# EAGLE design z0-probe_v2 (EAGLE 9.4.1)
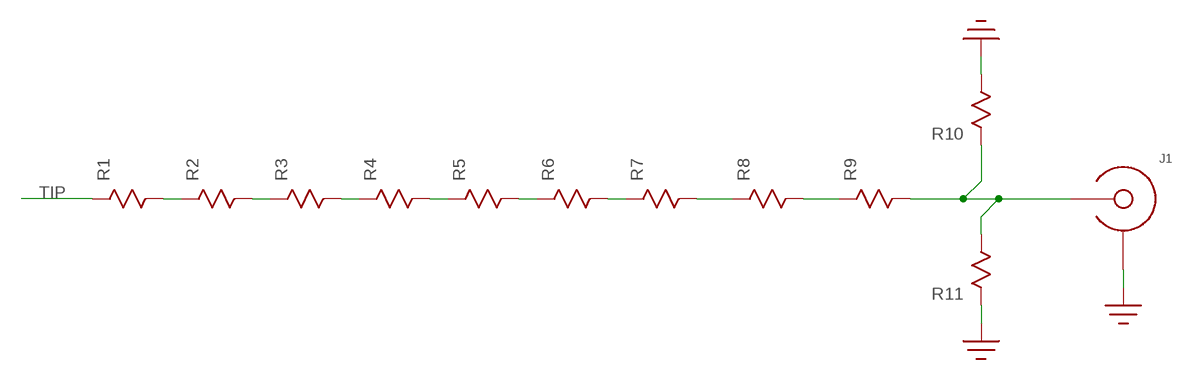
[diagram p0: schematic, sheet 1]

## Parts
J1  SMA-EDGE-LAUNCH  [SMA_EDGE_LAUNCH_2L_4020_TAPER_FIXED]
R1  R0603  [R0603]
R2  R0603  [R0603]
R3  R0603  [R0603]
R4  R0603  [R0603]
R5  R0603  [R0603]
R6  R0603  [R0603]
R7  R0603  [R0603]
R8  R0603  [R0603]
R9  R0603  [R0603]
R10  R0603  [R0603]
R11  R0603  [R0603]

## Nets
GND: J1.BOTTOM_GND(SHIELD) J1.GND@1(SHIELD) J1.GND@2(SHIELD) J1.GND@3(SHIELD) J1.GND@4(SHIELD) J1.GND@5(SHIELD) J1.GND@6(SHIELD) J1.GND@7(SHIELD) J1.GND@8(SHIELD) J1.GND@14(SHIELD) J1.GND@15(SHIELD) J1.GND@16(SHIELD) J1.GND@17(SHIELD) J1.GND_PAD1(SHIELD) J1.GND_PAD2(SHIELD) J1.P$1(SHIELD) J1.P$2(SHIELD) R10.P$2 R11.P$1
N$1: R1.P$2 R2.P$1
N$2: R2.P$2 R3.P$1
N$3: R3.P$2 R4.P$1
N$4: R4.P$2 R5.P$1
N$5: R5.P$2 R6.P$1
N$6: R6.P$2 R7.P$1
N$7: R7.P$2 R8.P$1
N$8: R8.P$2 R9.P$1
N$9: J1.CENTER@1(CENTER) J1.P$3(CENTER) R9.P$2 R10.P$1 R11.P$2
TIP: R1.P$1

## Library data of the parts
J1 = sma_footprint_2l:SMA-EDGE-LAUNCH
R1-R11 = yapo:R

## Board
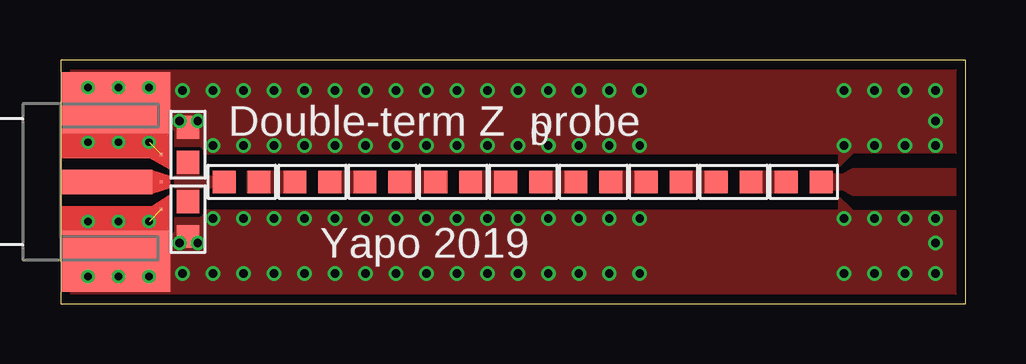
[diagram p1: board, top side]
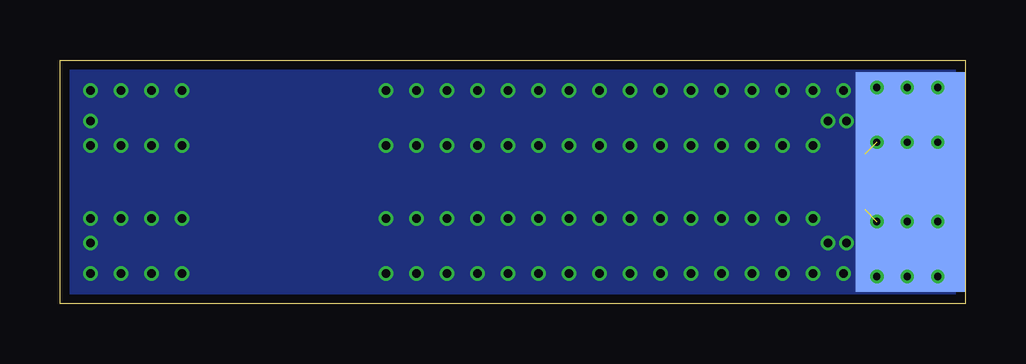
[diagram p2: board, bottom side, seen from below]

Size 37.72 x 10.16 mm. Coordinates in mm from the lower left corner, seen from the top.
Outline: 0,0 37.72,0 37.72,10.16 0,10.16 0,0
Copper layers (1*16): Top 0.035559375mm / dielectric 1.6mm / Bottom 0.035559375mm
Design rules "oshpark-2layer *": minimum track width 6mil, minimum drill 10mil, track to track 6mil, track to pad 6mil, pad to pad 6mil, via to via 6mil, smd to smd 6mil, copper to edge 15mil, drill to drill 6mil, minimum pad ring 5mil, minimum via ring 5mil, stop-mask expansion 2.5mil, vias tented up to drill 20mil, thermal gap 10mil

### Footprints (pad centres in the part's own frame; a part is rotated, then mirrored left to right if it is on the bottom)
SMA_EDGE_LAUNCH_2L_4020_TAPER_FIXED = smd 4.572 x 9.144 bottom: BOTTOM_GND 2.286,0 | smd 3.81 x 1.016: CENTER@1 1.905,0 | drill 0.3: GND@1 1.143,3.937; GND@2 3.683,3.937; GND@3 1.143,1.651; GND@4 3.683,1.651; GND@5 1.143,-1.651; GND@6 3.683,-1.651; GND@7 1.143,-3.937; GND@8 3.683,-3.937; GND@14 2.413,3.937; GND@15 2.413,-3.937; GND@16 2.413,-1.651; GND@17 2.413,1.651 | smd 4.572 x 2.54: GND_PAD1 2.286,3.302; GND_PAD2 2.286,-3.302 | smd 0.127 x 0.127: P$1 4.191,1.143; P$2 4.191,-1.143; P$3 4.191,0
R0603 = smd 0.95 x 0.95: P$1 -0.725,0; P$2 0.725,0

### Placement (x,y rotation side)
J1  0,5.08 0 top
R1  30.96,5.08 180 top
R2  28.04,5.08 180 top
R3  25.12,5.08 180 top
R4  22.2,5.08 180 top
R5  19.28,5.08 180 top
R6  16.36,5.08 180 top
R7  13.41,5.08 180 top
R8  10.49,5.08 180 top
R9  7.54,5.08 180 top
R10  5.31,6.63 90 top
R11  5.31,3.53 90 top

### Tracks (layer width: path | path; a pad name or v marks a point on that pad's centre or on a via)
GND  (via drill 0.35)  (2 unrouted)
  other vias: 6.35,6.6 7.62,6.6 8.89,6.6 10.16,6.6 11.43,6.6 12.7,6.6 13.97,6.6 15.24,6.6 16.51,6.6 17.78,6.6 19.05,6.6 20.32,6.6 21.59,6.6 22.86,6.6 24.13,6.6 6.35,3.56 7.62,3.56 8.89,3.56 10.16,3.56 11.43,3.56 12.7,3.56 13.97,3.56 15.24,3.56 16.51,3.56 17.78,3.56 19.05,3.56 20.32,3.56 21.59,3.56 22.86,3.56 24.13,3.56 4.95,7.62 5.71,7.62 4.95,2.54 5.71,2.54 5.08,8.89 6.35,8.89 7.62,8.89 8.89,8.89 10.16,8.89 11.43,8.89 12.7,8.89 13.97,8.89 15.24,8.89 16.51,8.89 17.78,8.89 19.05,8.89 20.32,8.89 21.59,8.89 22.86,8.89 24.13,8.89 32.64,8.89 33.91,8.89 35.18,8.89 5.08,1.27 6.35,1.27 7.62,1.27 8.89,1.27 10.16,1.27 11.43,1.27 12.7,1.27 13.97,1.27 15.24,1.27 16.51,1.27 17.78,1.27 19.05,1.27 20.32,1.27 21.59,1.27 22.86,1.27 24.13,1.27 32.64,1.27 33.91,1.27 35.18,1.27 32.64,6.6 33.91,6.6 35.18,6.6 35.18,3.56 33.91,3.56 32.64,3.56 36.45,8.89 36.45,6.6 36.45,3.56 36.45,1.27 36.45,2.54 36.45,7.62
  pour Top (isolate 0.152, rank 2, no thermals): 0,10.16 37.72,10.16 37.72,0 0,0
  pour Bottom: 0,0 37.72,0 37.72,10.16 0,10.16
  cutout Top: 5.84,4.55 5.84,3.96 32.38,3.96 32.38,4.55
  cutout Top: 33.02,5.71 37.34,5.71 37.34,6.22 33.02,6.22
  cutout Top: 33.02,4.45 33.02,3.94 37.34,3.94 37.34,4.45
  cutout Top: 33.02,6.22 32.38,5.59 33.02,5.71
  cutout Top: 33.02,3.94 33.02,4.45 32.38,4.57
  cutout Top: 5.84,6.2 5.84,5.74 32.38,5.74 32.38,6.2
N$1
  pour Top (no thermals): 28.45,4.67 30.63,4.67 30.63,5.49 28.45,5.49
N$2
  pour Top (no thermals): 25.53,4.67 27.64,4.67 27.64,5.49 25.53,5.49
N$3
  pour Top (no thermals): 22.58,4.67 24.71,4.67 24.71,5.49 22.58,5.49
N$4
  pour Top (no thermals): 19.66,4.67 21.79,4.67 21.79,5.49 19.66,5.49
N$5
  pour Top (no thermals): 16.66,4.67 18.97,4.67 18.97,5.49 16.66,5.49
N$6
  pour Top (no thermals): 13.74,4.67 16.08,4.67 16.08,5.49 13.74,5.49
N$7
  pour Top (no thermals): 10.9,4.67 13.06,4.67 13.06,5.49 10.9,5.49
N$8
  pour Top (no thermals): 7.82,4.67 10.16,4.67 10.16,5.49 7.82,5.49
N$9
  pour Top (no thermals): 1.73,4.88 6.81,4.88 6.81,5.28 1.73,5.28
  pour Top (no thermals): 4.9,5.87 5.71,5.87 5.71,4.34 4.9,4.34
TIP
  pour Top (no thermals): 32,5.36 32,4.8 32.64,4.8 33.02,4.57 37.72,4.57 37.72,5.59 33.02,5.59 32.64,5.36

### Text on the board
tPlace: Double-term Z probe | 0 | Yapo 2019